# EAGLE schematic FGPMMOPA6x (EAGLE 6.3)
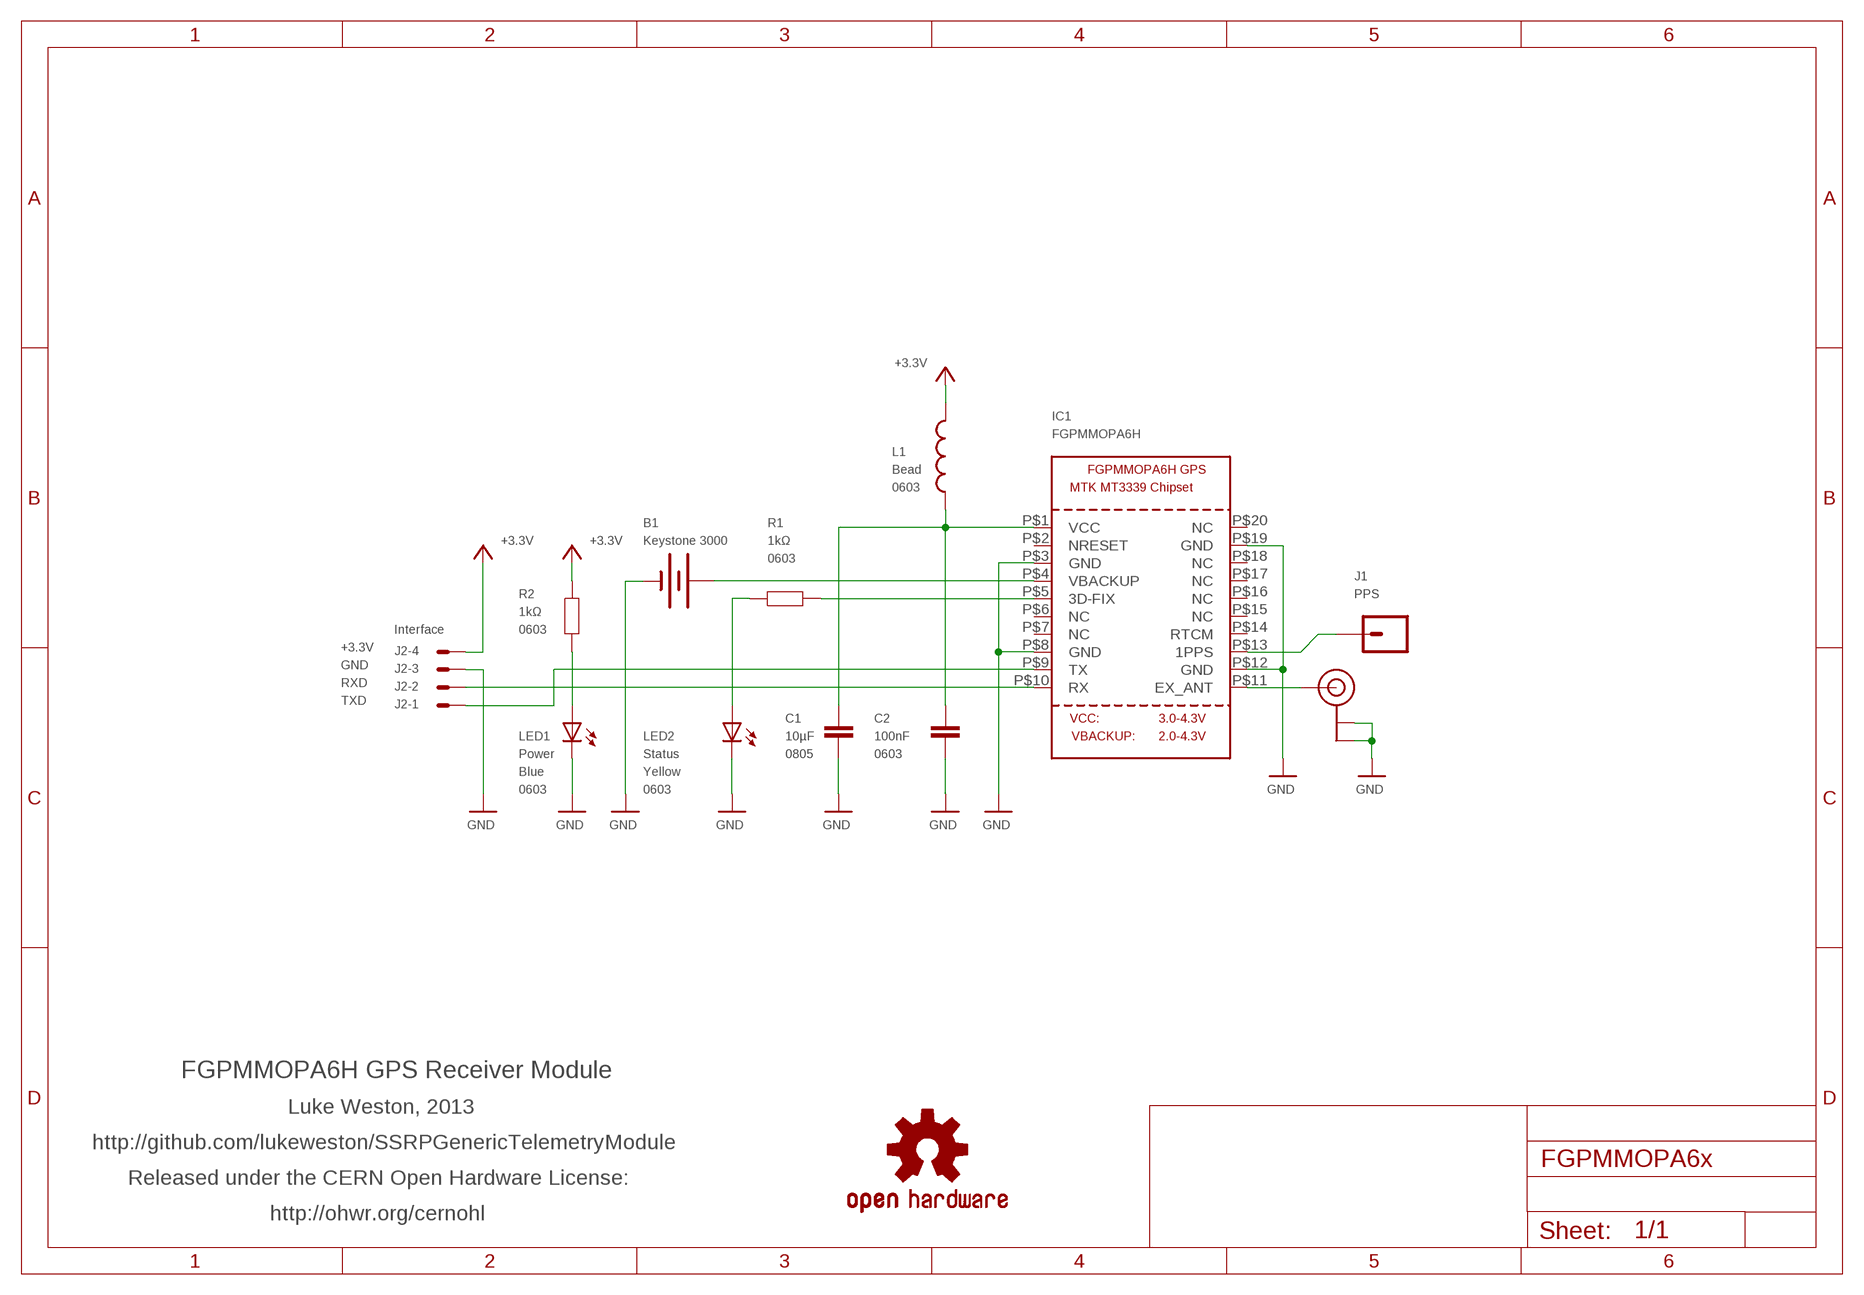
[diagram p0: schematic, sheet 1]

## Parts
B1  Keystone 3000  BATTERY12MM  [BATTCON_12MM]
C1  10µF  CAP0805  [0805]
C2  100nF  CAP0603  [0603]
IC1  FGPMMOPA6H  GPS_FGPMMOPA6H  [FGPMMOPA6H]
J1  PPS  M01PTH  [1X01]
J2  Interface  22-23-2041  [22-23-2041]
J3  U.FL  [U.FL]
L1  Bead  INDUCTOR0603  [0603]
LED1  Power  LED0603  [LED-0603]
LED2  Status  LED0603  [LED-0603]
R1  1kΩ  RESISTOR0603  [0603]
R2  1kΩ  RESISTOR0603  [0603]
SY  OSHW-LOGOS  [OSHW-LOGO-S]

## Nets
+3V3: J2.4 L1.2 R2.2 ; supply symbol labelled +3.3V
GND: B1.GND(-) C1.1 C2.1 IC1.P$3(GND) IC1.P$8(GND) IC1.P$12(GND) IC1.P$19(GND) J2.3 J3.P$1(GND) J3.P$2(GND) LED1.C LED2.C
N$8: C1.2 C2.2 IC1.P$1(VCC) L1.1
N$10: B1.PWR@1(+) IC1.P$4(VBACKUP)
N$13: IC1.P$5(3D-FIX) R1.2
N$14: IC1.P$9(TX) J2.1
N$15: IC1.P$10(RX) J2.2
N$16: IC1.P$13(1PPS) J1.1
N$17: IC1.P$11(EX_ANT) J3.P$3(SIGNAL)
N$19: LED2.A R1.1
N$20: LED1.A R2.1
Unconnected: IC1.P$2(NRESET) IC1.P$6(NC) IC1.P$7(NC) IC1.P$14(RTCM) IC1.P$15(NC) IC1.P$16(NC) IC1.P$17(NC) IC1.P$18(NC) IC1.P$20(NC)

## Notes on the sheet
- +3.3V
- GND
- RXD
- TXD
- FGPMMOPA6H GPS Receiver Module
- Luke Weston, 2013
- http://github.com/lukeweston/SSRPGenericTelemetryModule
- Released under the CERN Open Hardware License:
- http://ohwr.org/cernohl

## Library data of the parts
B1 = SparkFun:BATTERY: Battery Holders Various common sizes : AA, AAA, 20mm coin cell and 12mm coin cell.
C1 = freetronics-master-v1:CAP: Capacitor Standard 0603 ceramic capacitor, and 0.1" leaded capacitor.; PACKAGE: 0805
C2 = freetronics-master-v1:CAP: Capacitor Standard 0603 ceramic capacitor, and 0.1" leaded capacitor.; PACKAGE: 0603
IC1 = microbuilder:GPS_FGPMMOPA6H: GPS Module - MTK MT3339 Chipset, -165dBm sensitivity, 22 channels, 10Hz, auto-select external antenna options
J1 = freetronics-master-v1:M01: Header 1 Standard 1-pin 0.1" header. Use with straight break away headers (SKU : PRT-00116), right angle break away headers (PRT-00553), swiss pins (PRT-00743), machine pins (PRT-00117), and female headers (PRT-00115).
J2 = con-molex:22-23-2041: .100" (2.54mm) Center Header - 4 Pin; MF: MOLEX; MPN: 22-23-2041; OC_FARNELL: 1462920; OC_NEWARK: 38C0355
J3 = microbuilder:U.FL: U.FL Antenna Connector
L1 = freetronics-master-v1:INDUCTOR: Inductors Basic Inductor/Choke - 0603 and 1206. Footprints are not proven and vary greatly between part numbers.; PACKAGE: 0603
LED1 = freetronics-master-v1:LED: LEDs Standard schematic elements and footprints for 5mm, 3mm, 1206, and 0603 sized LEDs. 5mm - Spark Fun Electronics SKU : COM-00529 (and others); COLOUR: Blue; PACKAGE: 0603
LED2 = freetronics-master-v1:LED: LEDs Standard schematic elements and footprints for 5mm, 3mm, 1206, and 0603 sized LEDs. 5mm - Spark Fun Electronics SKU : COM-00529 (and others); COLOUR: Yellow; PACKAGE: 0603
R1 R2 = freetronics-master-v1:RESISTOR: Resistor Basic schematic elements and footprints for 0603, 1206, and PTH 1/10th watt (small) resistors.; PACKAGE: 0603
SY = SparkFun:OSHW-LOGO: Open Source Hardware Logo This logo indicates the piece of hardware it is found on incorporates a OSHW license and/or adheres to the definition of open source hardware found here: http://freedomdefined.org/OSHW